# EAGLE schematic OpenCm 9.04 (EAGLE 9.5.0)
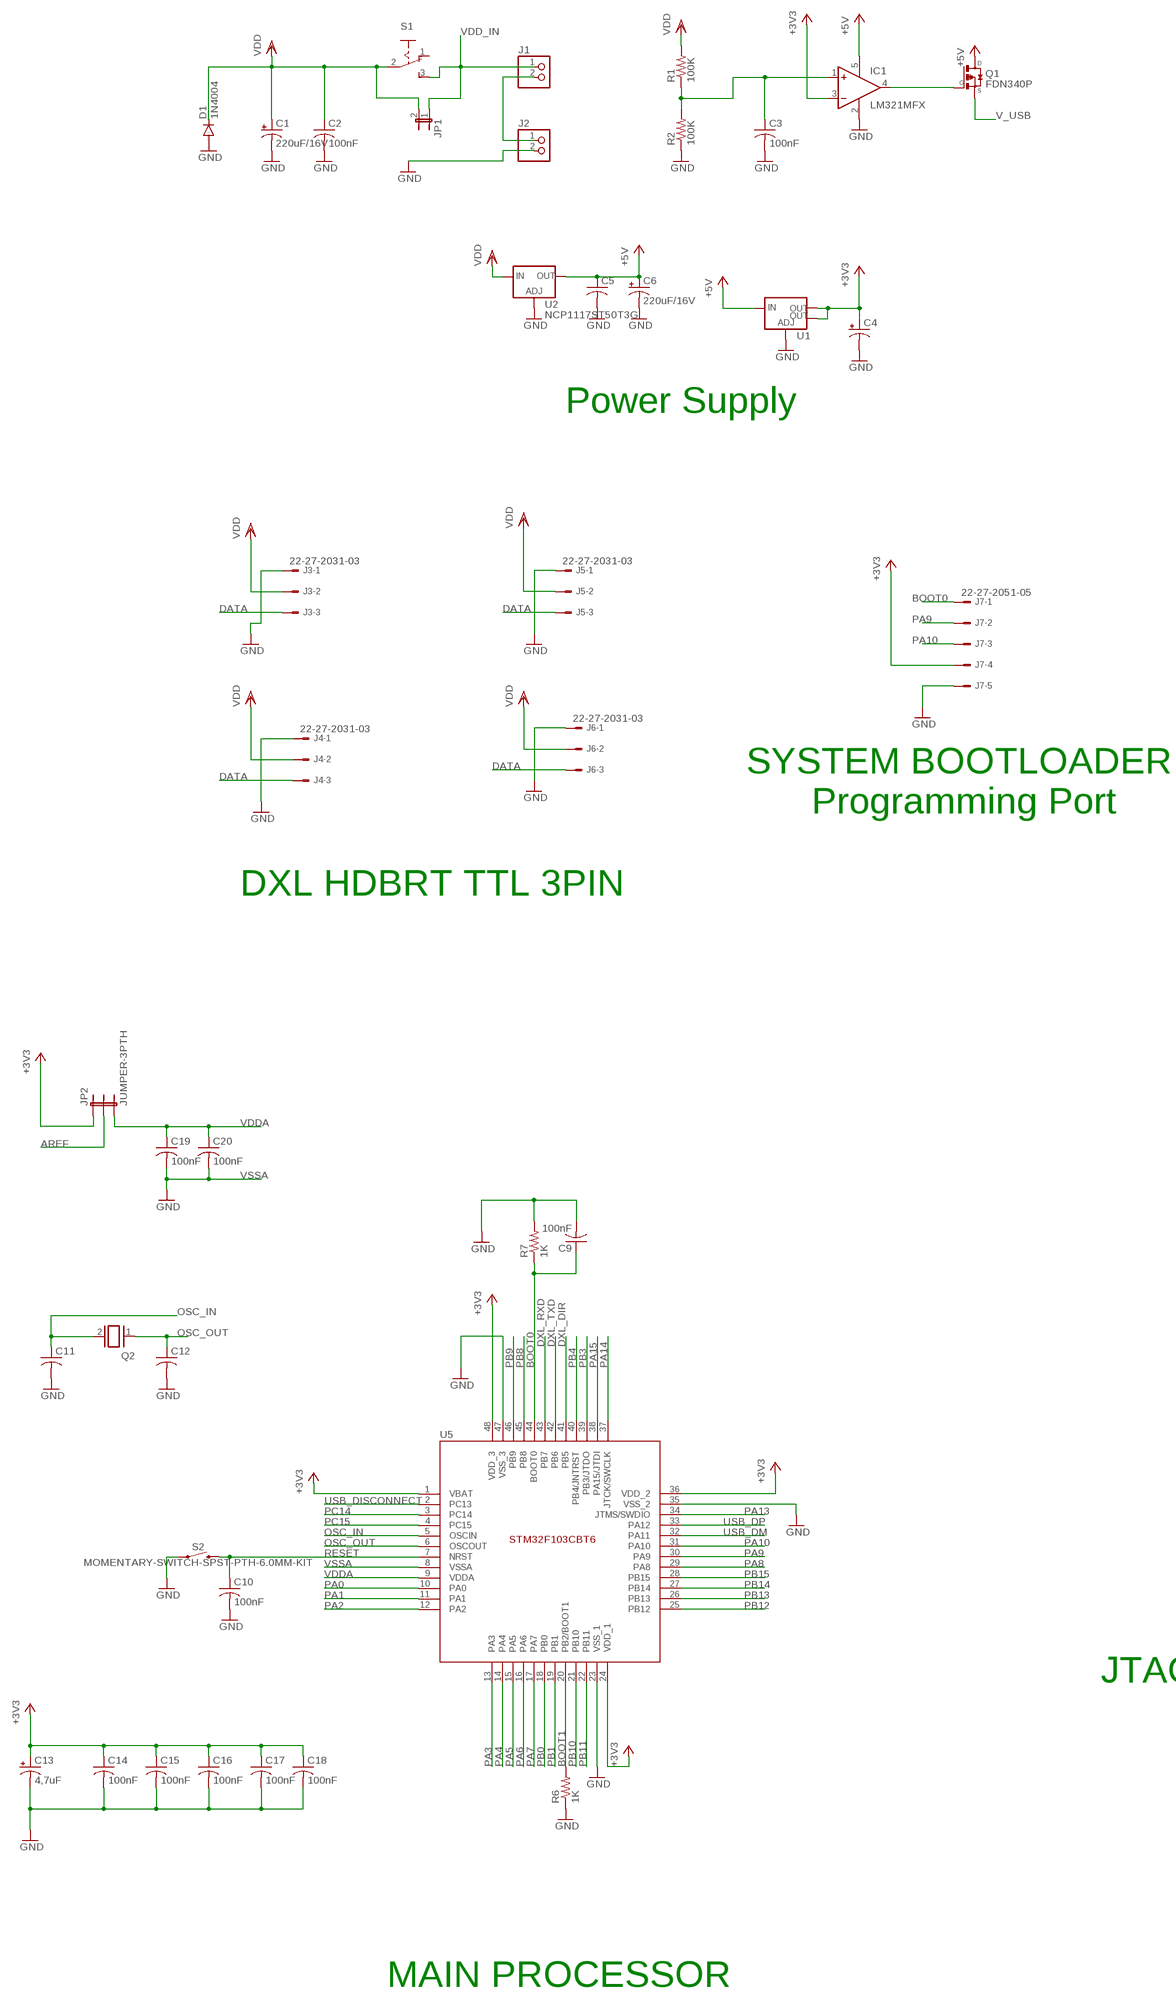
[diagram p0: schematic, sheet 1, part 1 of 2]
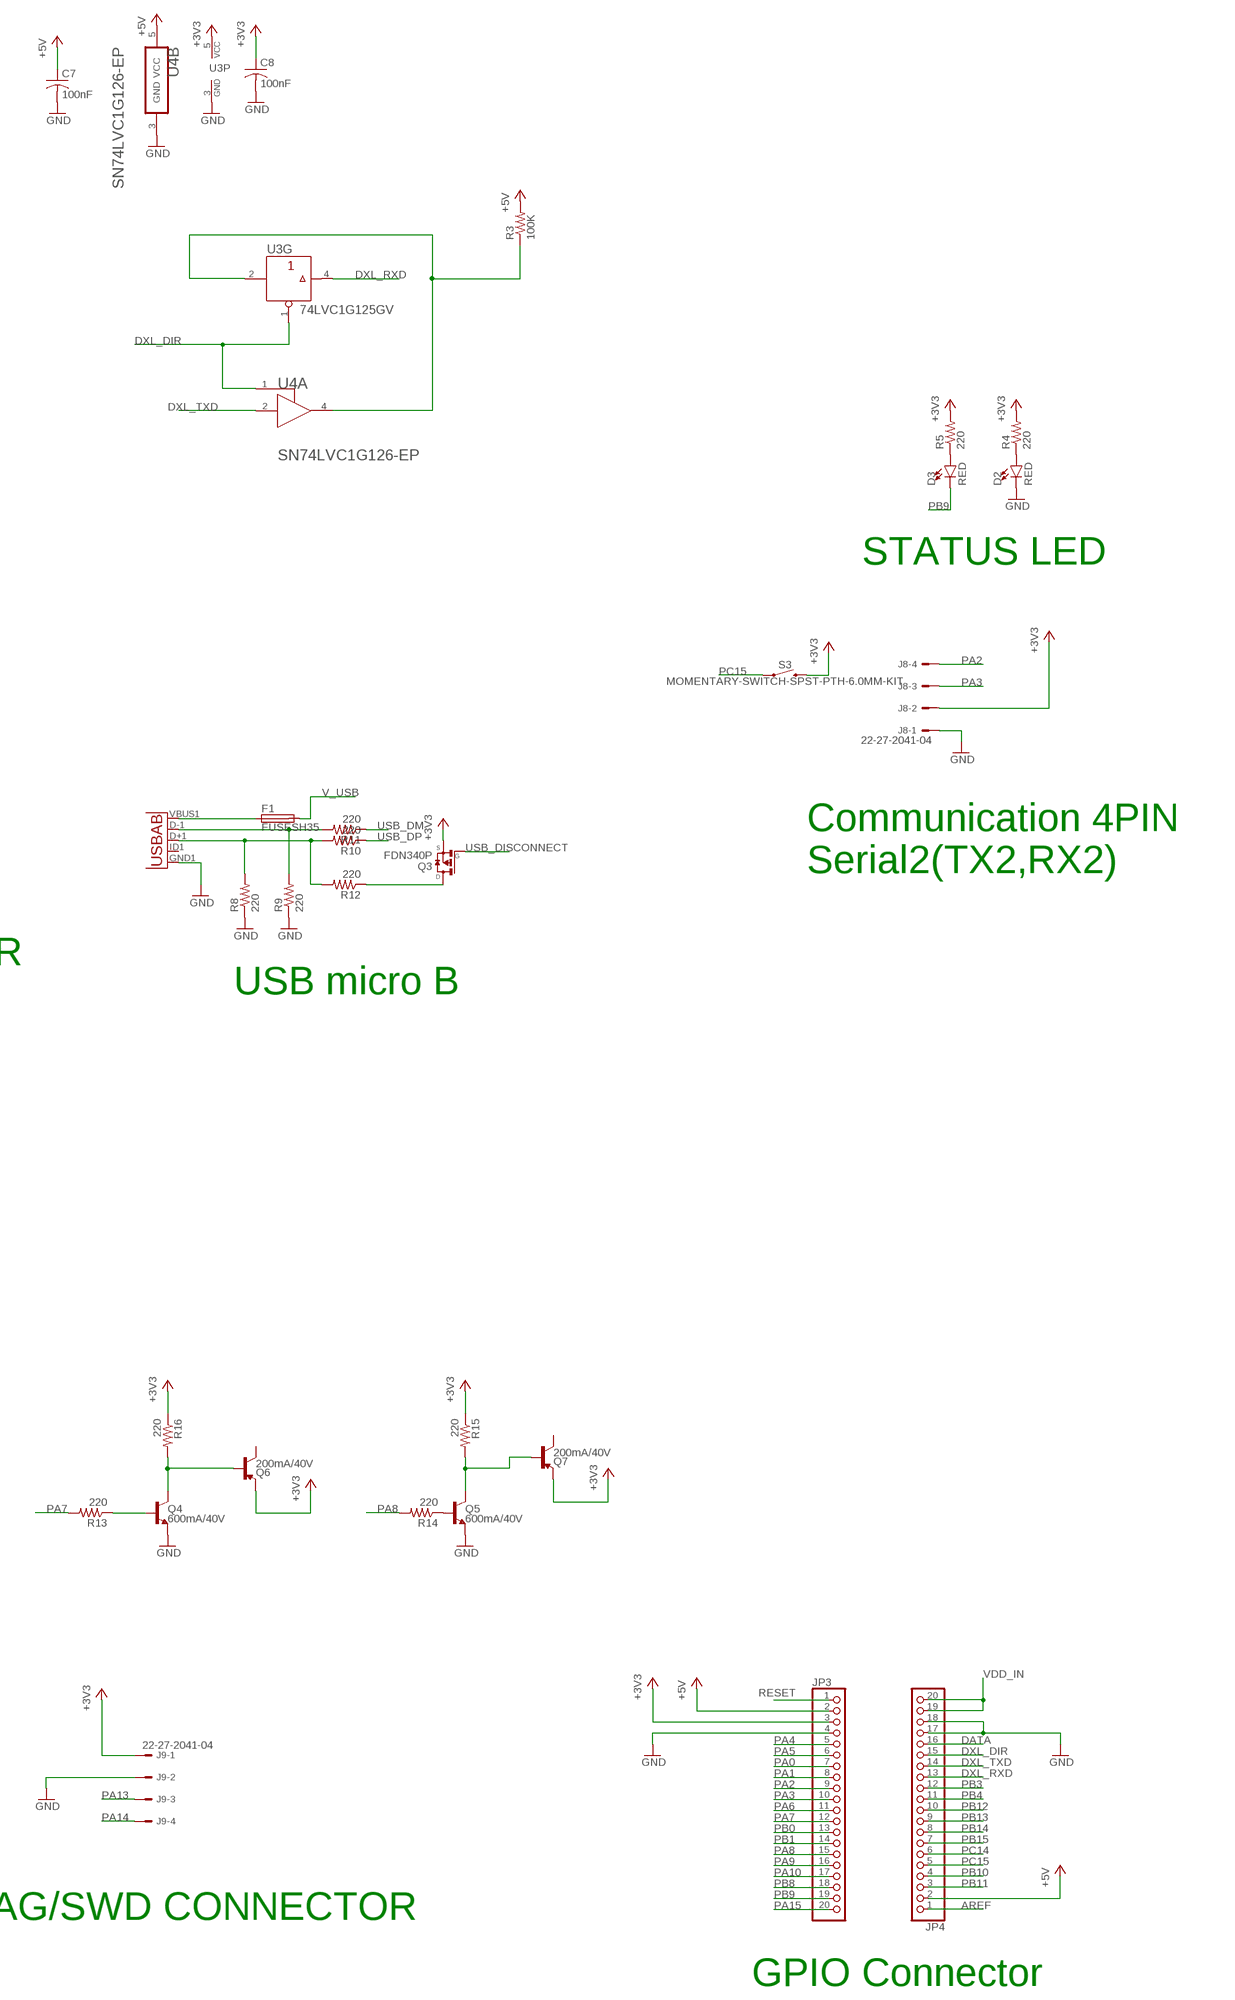
[diagram p1: schematic, sheet 1, part 2 of 2]

## Parts
C1  220uF/16V  CPOL-US153CLV-0810  [153CLV-0810]
C2  100nF  C-USC3216  [C3216]
C3  100nF  C-USC3216  [C3216]
C4  CPOL-USA/3216-18R  [A/3216-18R]
C5  C-USC3216  [C3216]
C6  220uF/16V  CPOL-US153CLV-0810  [153CLV-0810]
C7  100nF  C-USC3216  [C3216]
C8  100nF  C-USC3216  [C3216]
C9  100nF  C-USC3216  [C3216]
C10  100nF  C-USC3216  [C3216]
C11  C-US025-025X050  [C025-025X050]
C12  C-US025-025X050  [C025-025X050]
C13  4,7uF  CPOL-US153CLV-0810  [153CLV-0810]
C14  100nF  C-USC3216  [C3216]
C15  100nF  C-USC3216  [C3216]
C16  100nF  C-USC3216  [C3216]
C17  100nF  C-USC3216  [C3216]
C18  100nF  C-USC3216  [C3216]
C19  100nF  C-USC3216  [C3216]
C20  100nF  C-USC3216  [C3216]
D1  1N4004  [DO41-10]
D2  RED  LED-RED1206  [LED-1206]
D3  RED  LED-RED1206  [LED-1206]
F1  FUSESH35  [SH25]
IC1  LM321MFX  [SOT23-5]
J1  PINHD-1X2  [1X02]
J2  PINHD-1X2  [1X02]
J3  22-27-2031-03  [6410-03]
J4  22-27-2031-03  [6410-03]
J5  22-27-2031-03  [6410-03]
J6  22-27-2031-03  [6410-03]
J7  22-27-2051-05  [6410-05]
J8  22-27-2041-04  [6410-04]
J9  22-27-2041-04  [6410-04]
JP1  JUMPER-2PTH  [1X02]
JP2  JUMPER-3PTH  [1X03]
JP3  PINHD-1X20  [1X20]
JP4  PINHD-1X20  [1X20]
Q1  FDN340P  [SSOT-3]
Q2  XTAL/S  [QS]
Q3  FDN340P  [SSOT-3]
Q4  600mA/40V  TRANS_NPN-MMBT2222AL  [SOT23-3]
Q5  600mA/40V  TRANS_NPN-MMBT2222AL  [SOT23-3]
Q6  200mA/40V  TRANS_PNP-PMBT3906|MMBT3906L  [SOT23-3]
Q7  200mA/40V  TRANS_PNP-PMBT3906|MMBT3906L  [SOT23-3]
R1  100K  R-US_R1206  [R1206]
R2  100K  R-US_R1206  [R1206]
R3  100K  R-US_R1206  [R1206]
R4  220  R-US_R1206  [R1206]
R5  220  R-US_R1206  [R1206]
R6  1K  R-US_R1206  [R1206]
R7  1K  R-US_R1206  [R1206]
R8  220  R-US_R1206  [R1206]
R9  220  R-US_R1206  [R1206]
R10  220  R-US_R1206  [R1206]
R11  220  R-US_R1206  [R1206]
R12  220  R-US_R1206  [R1206]
R13  220  R-US_R1206  [R1206]
R14  220  R-US_R1206  [R1206]
R15  220  R-US_R1206  [R1206]
R16  220  R-US_R1206  [R1206]
S1  255SB  [255SB]
S2  MOMENTARY-SWITCH-SPST-PTH-6.0MM-KIT  [TACTILE_SWITCH_PTH_6.0MM_KIT]
S3  MOMENTARY-SWITCH-SPST-PTH-6.0MM-KIT  [TACTILE_SWITCH_PTH_6.0MM_KIT]
U1  V_REG_LM1117SOT223  [SOT223]
U2  NCP1117ST50T3G  V_REG_317SMD  [SOT223]
U3  74LVC1G125GV  [SOT753]
U4  TEXAS_INSTRUMENTS_SN74LVC1G126-EPTEXAS_INSTRUMENTS_SN74LVC1G126-EP_0_1  [TEXAS_INSTRUMENTS_SN74LVC1G126-EP_1]
U5  STM32F103CBT6  [LQFP48]
U6  USB""  [USB-MICRO-SMD]

## Nets
+3V3: C4.+ C8.1 C13.+ C14.1 C15.1 C16.1 C17.1 C18.1 IC1.3(-IN) J7.4 J8.2 J9.1 JP2.1 JP3.3 Q3.2(S) Q6.2(E) Q7.2(E) R4.2 R5.2 R15.1 R16.1 S3.3 U1.2(OUT) U1.4(OUT) U3.5(P:VCC) U5.1(VBAT) U5.24(VDD_1) U5.36(VDD_2) U5.48(VDD_3)
+5V: C5.1 C6.+ C7.1 IC1.5(V+) JP3.2 JP4.2 Q1.3(D) R3.2 U1.3(IN) U2.2(OUT) U4.5(B:VCC)
AREF: JP2.2 JP4.1
BOOT0: C9.1 J7.1 R7.1 U5.44(BOOT0)
BOOT1: R6.2 U5.20(PB2/BOOT1)
DATA: J3.3 J4.3 J5.3 J6.3 JP4.16
DXL_DIR: JP4.15 U3.1(G:OEN) U4.1(A:OE) U5.41(PB5)
DXL_RXD: JP4.13 U3.4(G:Y) U5.43(PB7)
DXL_TXD: JP4.14 U4.2(A:A) U5.42(PB6)
GND: C1.- C2.2 C3.2 C4.- C5.2 C6.- C7.2 C8.2 C9.2 C10.2 C11.2 C12.2 C13.- C14.2 C15.2 C16.2 C17.2 C18.2 D1.A D2.C IC1.2(V-) J2.2 J3.1 J4.1 J5.1 J6.1 J7.5 J8.1 J9.2 JP3.4 JP4.17 JP4.18 Q4.2(E) Q5.2(E) R2.1 R6.1 R7.2 R8.1 R9.1 S2.1 U1.1(ADJ) U2.1(ADJ) U3.3(P:GND) U4.3(B:GND) U5.23(VSS_1) U5.35(VSS_2) U5.47(VSS_3) U6.GND1(GND)
N$1: C3.1 IC1.1(+IN) R1.1 R2.2
N$2: R3.1 U3.2(G:A) U4.4(A:Y)
N$3: J1.2 J2.1
N$4: IC1.4(OUT) Q1.1(G)
N$5: D2.A R4.1
N$6: D3.A R5.1
N$7: Q3.3(D) R12.1
N$8: R8.2 R10.2 R12.2 U6.D+1(D+)
N$9: R9.2 R11.2 U6.D-1(D-)
N$10: F1.1 U6.VBUS1(VBUS)
N$11: Q5.1(B) R14.1
N$12: Q5.3(C) Q7.1(B) R15.2
N$13: Q4.3(C) Q6.1(B) R16.2
N$14: Q4.1(B) R13.1
OSC_IN: C11.1 Q2.2 U5.5(OSCIN)
OSC_OUT: C12.1 Q2.1 U5.6(OSCOUT)
PA0: JP3.7 U5.10(PA0)
PA1: JP3.8 U5.11(PA1)
PA2: J8.4 JP3.9 U5.12(PA2)
PA3: J8.3 JP3.10 U5.13(PA3)
PA4: JP3.5 U5.14(PA4)
PA5: JP3.6 U5.15(PA5)
PA6: JP3.11 U5.16(PA6)
PA7: JP3.12 R13.2 U5.17(PA7)
PA8: JP3.15 R14.2 U5.29(PA8)
PA9: J7.2 JP3.16 U5.30(PA9)
PA10: J7.3 JP3.17 U5.31(PA10)
PA13: J9.3 U5.34(JTMS/SWDIO)
PA14: J9.4 U5.37(JTCK/SWCLK)
PA15: JP3.20 U5.38(PA15/JTDI)
PB0: JP3.13 U5.18(PB0)
PB1: JP3.14 U5.19(PB1)
PB3: JP4.12 U5.39(PB3/JTDO)
PB4: JP4.11 U5.40(PB4/JNTRST)
PB8: JP3.18 U5.45(PB8)
PB9: D3.C JP3.19 U5.46(PB9)
PB10: JP4.4 U5.21(PB10)
PB11: JP4.3 U5.22(PB11)
PB12: JP4.10 U5.25(PB12)
PB13: JP4.9 U5.26(PB13)
PB14: JP4.8 U5.27(PB14)
PB15: JP4.7 U5.28(PB15)
PC14: JP4.6 U5.3(PC14)
PC15: JP4.5 S3.1 U5.4(PC15)
RESET: C10.1 JP3.1 S2.3 U5.7(NRST)
USB_DISCONNECT: Q3.1(G) U5.2(PC13)
USB_DM: R11.1 U5.32(PA11)
USB_DP: R10.1 U5.33(PA12)
V_USB: F1.2 Q1.2(S)
VDD: C1.+ C2.1 D1.C J3.2 J4.2 J5.2 J6.2 JP1.2 R1.2 S1.2(P) U2.3(IN)
VDD_IN: J1.1 JP1.1 JP4.19 JP4.20 S1.3(S)
VDDA: C19.1 C20.1 JP2.3 U5.9(VDDA)
VSSA: C19.2 C20.2 U5.8(VSSA) ; supply symbol labelled GND
Unconnected: Q6.3(C) Q7.3(C) S1.1(O) U6.ID1(USBID)

## Notes on the sheet
- STATUS LED
- Power Supply
- Communication 4PIN 
  Serial2(TX2,RX2)
- SYSTEM BOOTLOADER 
  Programming Port
- USB micro B
- DXL HDBRT TTL 3PIN
- JTAG/SWD CONNECTOR
- GPIO Connector
- MAIN PROCESSOR

## Library data of the parts
C1 C4 C6 C13 = rcl:CPOL-US: POLARIZED CAPACITOR, American symbol; SPICEPREFIX: C
C2 C3 C5 C7-C12 C14-C20 = rcl:C-US: CAPACITOR, American symbol; SPICEPREFIX: C
D1 = diode:1N4004: DIODE general purpose rectifier, 1 A
D2 D3 = SparkFun-LED:LED-RED: Red SMD LED Used in manufacturing of most products at SparkFun Packages: 0603 - SMD 0603 package [Product Link] <http://docs.avagotech.com/docs/AV02-0551EN> 0603 SMART - SMD 0603 SMART package ( more efficient and expensive)[Product Link] <http://www.osram-os.com/Graphics/XPic2/00077099_0.pdf> 1206 - SMD1206 package [Product Link] <https://www.sparkfun.com/datasheets/DevTools/LilyPad/Q150OVS4.pdff> SparkFun Products: Pro Mini 328 -5V <https://www.sparkfun.com/products/821> RedBoard <https://www.sparkfun.com/products/12757> IOIO-OTG <https://www.sparkfun.com/products/13613>; PROD_ID: DIO-09912
F1 = fuse:FUSE: Fuse; OC_FARNELL: unknown; OC_NEWARK: unknown
IC1 = linear:LM321?*: Low Power Single Op Amp Source: http://cache.national.com/ds/LM/LM321.pdf
J1 J2 = pinhead:PINHD-1X2: PIN HEADER
J3-J6 = con-molex:22-?-03: CONNECTOR wire to board 2.54 mm (.1 inch) pitch header; MF: MOLEX; OC_FARNELL: unknown; OC_NEWARK: unknown
J7 = con-molex:22-?-05: CONNECTOR wire to board 2.54 mm (.1 inch) pitch header; MF: MOLEX; OC_FARNELL: unknown; OC_NEWARK: unknown
J8 J9 = con-molex:22-?-04: CONNECTOR wire to board 2.54 mm (.1 inch) pitch header; MF: MOLEX; OC_FARNELL: unknown; OC_NEWARK: unknown
JP1 = SparkFun-Retired:JUMPER-2: Jumper Basic 0.1" spaced jumper. Use with breakaway headers.
JP2 = SparkFun-Retired:JUMPER-3
JP3 JP4 = pinhead:PINHD-1X20: PIN HEADER
Q1 Q3 = FDN340P:FDN340P: P-Channel MOSFET Logic Level, PowerTrench MOSFET Check prices <https://pricing.snapeda.com/parts/FDN340P/ON%20Semiconductor/view-part?ref=eda>; AVAILABILITY: Good; DESCRIPTION: P-Channel 20V 2A (Ta) 500mW (Ta) Surface Mount SuperSOT-3; MF: ON Semiconductor; MP: FDN340P; PACKAGE: None; PRICE: None; PURCHASE-URL: https://pricing.snapeda.com/search/part/FDN340P/?ref=eda
Q2 = special:XTAL/S: CRYSTAL
Q4 Q5 = SparkFun-DiscreteSemi:TRANS_NPN: NPN transistor Current controlled devices typically used to amplify current or used as a switch. BC547 - COM-08928 <http://www.sparkfun.com/products/8928> (TO-92 45V 100mA) (1.Collector 2.Base 3.Emitter) 2N3904 - COM-00521 <http://www.sparkfun.com/products/521> (TO-92 40V 200mA) (1.Emitter 2.Base 3.Collector) P2N2222A - COM-12852 <http://www.sparkfun.com/products/12852> (TO-92 40V 600mA) (1.Collector 2.Base 3.Emitter); PROD_ID: TRANS-08049
Q6 Q7 = SparkFun-DiscreteSemi:TRANS_PNP: PNP transistor Current controlled devices typically used to amplify current or used as a switch. SparkFun Products: SparkFun Serial Enabled 16x2 LCD - Red on Black <https://www.sparkfun.com/products/9068> SparkFun Logomatic <https://www.sparkfun.com/products/12772>; PROD_ID: TRANS-08052
R1-R16 = rcl:R-US_: RESISTOR, American symbol; SPICEPREFIX: R
S1 = switch:255SB: SLIDING SWITCH Distributor Buerklin, 11G810
S2 S3 = SparkFun-Switches:MOMENTARY-SWITCH-SPST: Momentary Switch (Pushbutton) - SPST Normally-open (NO) SPST momentary switches (buttons, pushbuttons). Variants PTH-12MM - 12mm square, through-hole Momentary Pushbutton Switch - 12mm Square <https://www.sparkfun.com/products/9190> (COM-09190) PTH-6.0MM, PTH-6.0MM-KIT - 6.0mm square, through-hole Mini Pushbutton Switch <https://www.sparkfun.com/products/97> (COM-00097) KIT package intended for soldering kit's - only one side of pads' copper is exposed. PTH-RIGHT-ANGLE-KIT - Right-angle, through-hole Right Angle Tactile Button <https://www.sparkfun.com/products/10791> - Used on SparkFun BigTime Watch Kit <https://www.sparkfun.com/products/11734> SMD-12MM - 12mm square, surface-mount Tactile Button - SMD (12mm) <https://www.sparkfun.com/products/12993> (COM-12993) Used on SparkFun PicoBoard <https://www.sparkfun.com/products/11888> SMD-4.5MM - 4.5mm Square Trackball Switch Used on SparkFun Blackberry Trackballer Breakout <https://www.sparkfun.com/products/13169> SMD-4.6MMX2.8MM - 4.60mm x 2.80mm, surface mount Used on SparkFun SAMD21 Mini Breakout <https://www.sparkfun.com/products/13664> SMD-5.2MM, SMD-5.2-REDUNDANT - 5.2mm square, surface-mount Mini Pushbutton Switch - SMD <https://www.sparkfun.com/products/8720> (COM-08720) Used on Arduino Pro Mini <https://www.sparkfun.com/products/11114> REDUNDANT package connects both switch circuits together SMD-6.0X3.5MM - 6.0 x 3.5mm, surface mount Momentary Reset Switch SMD <https://www.sparkfun.com/products/8229> (COM-08229) SMD-6.2MM-TALL - 6.2mm square, surface mount Tactile Button - SMD (6mm) <https://www.sparkfun.com/products/12992> Used on SparkFun Digital Sandbox <https://www.sparkfun.com/products/12651> SMD-RIGHT-ANGLE - Right-angle, surface mount Used on SparkFun Block for Intel® Edison - Arduino <https://www.sparkfun.com/products/13036>; PROD_ID: SWCH-08441; SF_SKU: COM-00097
U1 = SparkFun-IC-Power:V_REG_LM1117: Voltage Regulator LM1117 Standard adjustable voltage regulator but in SMD form. Spark Fun Electronics SKU : COM-00595; PROD_ID: VREG-08170
U2 = SparkFun-IC-Power:V_REG_317: Voltage Regulator Standard LM317 adjustable voltage regulator. AOI (Adjust Output Input). Google 'LM317 Calculator' for easy to use app to get the two resistor values needed. 240/720 for 5V output. 240/390 for 3.3V output. Spark Fun Electronics SKU : COM-00527
U3 = 74lvc1g125:74LVC1G125: Bus buffer/line driver; 3-state The 74LVC1G125 provides one non-inverting buffer/line driver with 3-state output. The 3-state output is controlled by the output enable input (OE). A HIGH-level at pin OE causes the output to assume a high-impedance OFF-state. The input can be driven from either 3.3 V or 5 V devices. This feature allows the use of this device in a mixed 3.3 V and 5 V environment. This device is fully specified for partial power-down applications using IOFF. The IOFF circuitry disables the output, preventing the damaging backflow current through the device when it is powered down. AAL Eindhoven MK
U4 = Texas Instruments - SN74LVC1G126-EP:TEXAS_INSTRUMENTS_SN74LVC1G126-EP: TI-SN74XXXXXX126-5; 3_STATE_OUTPUT: Yes; BITS: 1; CIIVA_IDS: 1347702; DATASHEET_VERSION: SCES527A; FOOTPRINT_VARIANT_NAME_0: Level C; FOOTPRINT_VARIANT_NAME_1: Level B; FOOTPRINT_VARIANT_NAME_2: Level A; F__NOM_VOLTAGEMAXMHZ: 150; ICC__NOM_VOLTAGEMAXMA: 0.01; IMPORTED: yes; IMPORTED_FROM: vault; IMPORT_TS: 1521845090; INPUT_TYPE: CMOS/TTL; LOGIC: true; MF: Texas Instruments; MPN: SN74LVC1G126-EP; OPERATING_TEMPERATURE_RANGEC: -40 to 85; OUTPUT_DRIVE_IOLIOHMAXMA: 32/-32; OUTPUT_TYPE: CMOS; PACKAGE: DCK0005A; PIN_0_0_1_OUTSIDE_EDGE: dot; PREFIX: U; RATING: HiRel Enhanced Product; RELEASE_DATE: 1459324397; SCHMITT_TRIGGER: No; SUB__FAMILY: Non-Inverting Buffer/Driver; TECHNOLOGY_FAMILY: LVC; TPD__NOM_VOLTAGEMAXNS: 8,5.5,4.5,4; VAULT_GUID: FC291B1D-47BC-459E-8242-F621DAB920F9; VAULT_REVISION: 7D8824B2-3733-4A03-A8E5-642693F9954C; VCC_MAX_V: 5.5; VCC_MIN_V: 1.65; VOLTAGE_NOM_V: 1.8,2.5,3.3,5
U5 = DAPule-STM32F103-v1.1.0:STM32F103CBT6: ARM® Cortex®-M3 STM32 F1 Microcontroller IC 32-Bit 72MHz 128KB (128K x 8) FLASH; MF: STMicroelectronics; MFN: STM32F103CBT6; OC-DIGIKEY: 497-6288-ND; OC-MOUSER: 511-STM32F103CBT6; OC-NEWARK: 11N8296
U6 = MicroUsbSMD:USB: This is a USB AB connector that is compatible with USB OTG. i.e. this connector can serve as a host or device